# EAGLE design touch_555 (EAGLE 6.5.0)
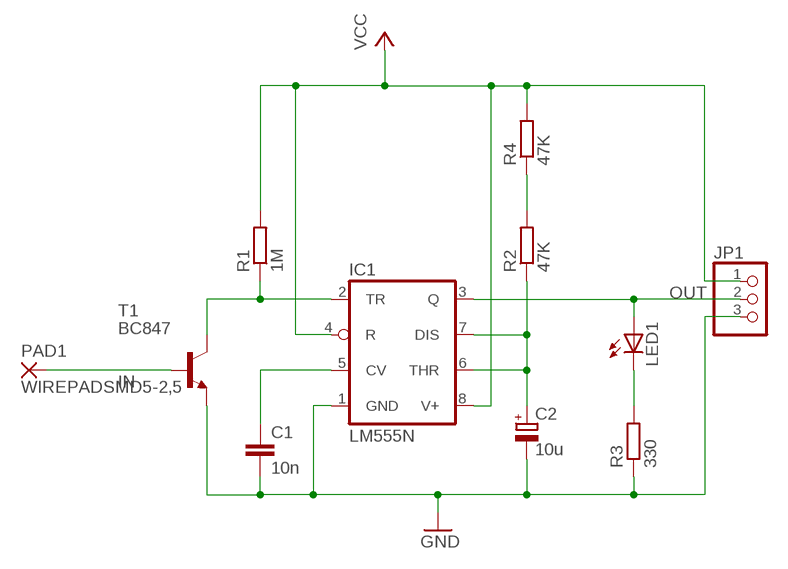
[diagram p0: schematic, sheet 1]

## Parts
C1  10n  C-EUC0805  [C0805]
C2  10u  CPOL-EUE2.5-6  [E2,5-6]
IC1  LM555N  [DIL08]
JP1  PINHD-1X3  [1X03]
LED1  LEDCHIPLED_1206  [CHIPLED_1206]
PAD1  WIREPADSMD5-2,5  [5-2,5]
R1  1M  R-EU_R0805  [R0805]
R2  47K  R-EU_R0805  [R0805]
R3  330  R-EU_R0805  [R0805]
R4  47K  R-EU_R0805  [R0805]
T1  BC847  [SOT23]

## Nets
GND: C1.2 C2.- IC1.1(GND) JP1.3 R3.1 T1.2(E)
IN: PAD1.1(P) T1.1(B)
N$2: LED1.C R3.2
N$3: R2.2 R4.1
N$4: C1.1 IC1.5(CV)
N$5: IC1.2(TR) R1.1 T1.3(C)
N$6: C2.+ IC1.6(THR) IC1.7(DIS) R2.1
OUT: IC1.3(Q) JP1.2 LED1.A
VCC: IC1.4(R) IC1.8(V+) JP1.1 R1.2 R4.2

## Library data of the parts
C1 = resistor:C-EU: CAPACITOR, European symbol
C2 = rcl:CPOL-EU: POLARIZED CAPACITOR, European symbol
IC1 = linear:*555: TIMER
JP1 = pinhead:PINHD-1X3: PIN HEADER
LED1 = led:LED: LED OSRAM: - CHIPLED LG R971, LG N971, LY N971, LG Q971, LY Q971, LO R971, LY R971 LH N974, LH R974 LS Q976, LO Q976, LY Q976 LO Q996 - Hyper CHIPLED LW Q18S LB Q993, LB Q99A, LB R99A - SideLED LS A670, LO A670, LY A670, LG A670, LP A670 LB A673, LV A673, LT A673, LW A673 LH A674 LY A675 LS A676, LA A676, LO A676, LY A676, LW A676 LS A679, LY A679, LG A679 - Hyper Micro SIDELED® LS Y876, LA Y876, LO Y876, LY Y876 LT Y87S - SmartLED LW L88C, LW L88S LB L89C, LB L89S, LG L890 LS L89K, LO L89K, LY L89K LS L896, LA L896, LO L896, LY L896 - TOPLED LS T670, LO T670, LY T670, LG T670, LP T670 LSG T670, LSP T670, LSY T670, LOP T670, LYG T670 LG T671, LOG T671, LSG T671 LB T673, LV T673, LT T673, LW T673 LH T674 LS T676, LA T676, LO T676, LY T676, LB T676, LH T676, LSB T676, LW T676 LB T67C, LV T67C, LT T67C, LS T67K, LO T67K, LY T67K, LW E67C LS E67B, LA E67B, LO E67B, LY E67B, LB E67C, LV E67C, LT E67C LW T67C LS T679, LY T679, LG T679 LS T770, LO T770, LY T770, LG T770, LP T770 LB T773, LV T773, LT T773, LW T773 LH T774 LS E675, LA E675, LY E675, LS T675 LS T776, LA T776, LO T776, LY T776, LB T776 LHGB T686 LT T68C, LB T68C - Hyper Mini TOPLED® LB M676 - Mini TOPLED Santana® LG M470 LS M47K, LO M47K, LY M47K Source: http://www.osram.convergy.de LUXEON: - LUMILED® LXK2-PW12-R00, LXK2-PW12-S00, LXK2-PW14-U00, LXK2-PW14-V00 LXK2-PM12-R00, LXK2-PM12-S00, LXK2-PM14-U00 LXK2-PE12-Q00, LXK2-PE12-R00, LXK2-PE12-S00, LXK2-PE14-T00, LXK2-PE14-U00 LXK2-PB12-K00, LXK2-PB12-L00, LXK2-PB12-M00, LXK2-PB14-N00, LXK2-PB14-P00, LXK2-PB14-Q00 LXK2-PR12-L00, LXK2-PR12-M00, LXK2-PR14-Q00, LXK2-PR14-R00 LXK2-PD12-Q00, LXK2-PD12-R00, LXK2-PD12-S00 LXK2-PH12-R00, LXK2-PH12-S00 LXK2-PL12-P00, LXK2-PL12-Q00, LXK2-PL12-R00 Source: www.luxeon.com KINGBRIGHT: KA-3528ASYC Source: www.kingbright.com
PAD1 = wirepad:WIREPAD: Wire PAD connect wire on PCB
R1-R4 = resistor:R-EU_: RESISTOR, European symbol
T1 = transistor:BC847: NPN TRANSISTOR

## Board
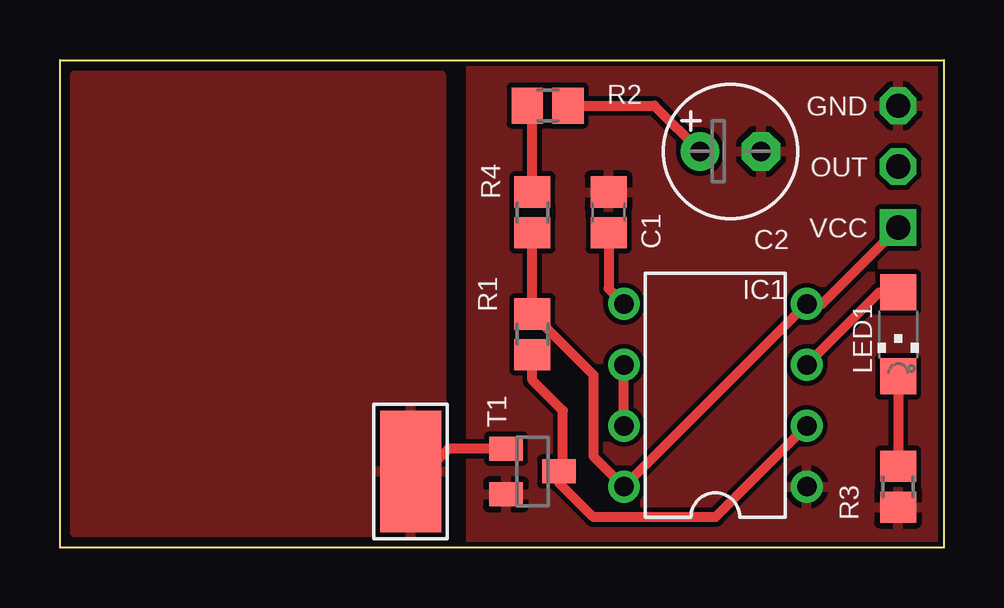
[diagram p1: board, top side]
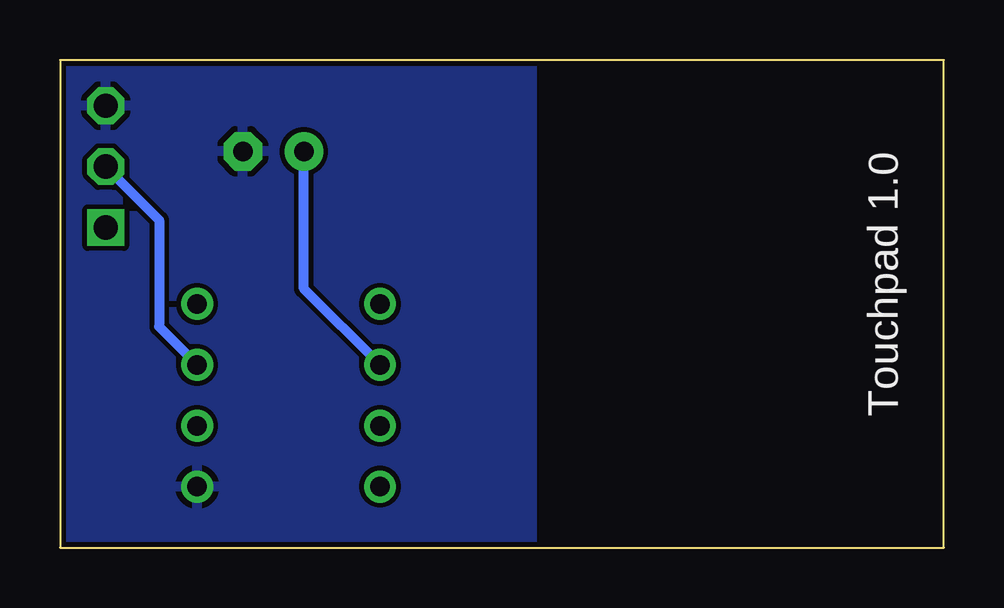
[diagram p2: board, bottom side, seen from below]

Size 36.83 x 20.32 mm. Coordinates in mm from the lower left corner, seen from the top.
Outline: 0,0 0,20.32 36.83,20.32 36.83,0 0,0
Copper layers (1*16): Top 0.035mm / dielectric 1.5mm / Bottom 0.035mm
Design rules "default *": minimum track width 10mil, minimum drill 24mil, track to track 8mil, track to pad 8mil, pad to pad 8mil, via to via 8mil, smd to smd 8mil, copper to edge 8mil, drill to drill 8mil, minimum pad ring 10mil, minimum via ring 8mil, stop-mask expansion 4mil, vias tented up to drill 0mil, thermal gap 10mil

### Footprints (pad centres in the part's own frame; a part is rotated, then mirrored left to right if it is on the bottom)
C0805 = smd 1.3 x 1.5: 1 -0.85,0; 2 0.85,0
E2,5-6 = drill 0.813 pad 1.6: + -1.27,0 | drill 0.813 pad 1.6 octagon: - 1.27,0
DIL08 = drill 0.813 pad 1.27: 1 -3.81,-3.81; 2 -1.27,-3.81; 3 1.27,-3.81; 4 3.81,-3.81; 5 3.81,3.81; 6 1.27,3.81; 7 -1.27,3.81; 8 -3.81,3.81
1X03 = drill 1.016 square: 1 -2.54,0 | drill 1.016 octagon: 2 0,0; 3 2.54,0
CHIPLED_1206 = smd 1.5 x 1.5: A 0,-1.75; C 0,1.75
5-2,5 = smd 2.54 x 5.08: 1 0,0
R0805 = smd 1.3 x 1.5: 1 -0.85,0; 2 0.85,0
SOT23 = smd 1 x 1.4: 1 -0.95,-1.1; 2 0.95,-1.1; 3 0,1.1

### Placement (x,y rotation side)
C1  22.86,13.97 90 top
C2  27.94,16.51 0 top
IC1  27.3,6.35 90 top
JP1  34.92,15.88 90 top
LED1  34.92,8.89 180 top
PAD1  14.61,3.18 0 top
R1  19.68,8.89 90 top
R2  20.32,18.41 180 top
R3  34.92,2.54 90 top
R4  19.68,13.97 270 top
T1  19.68,3.18 270 top

### Tracks (layer width: path | path; a pad name or v marks a point on that pad's centre or on a via)
GND
  pour Top: 17.14,26.67 41.27,26.67 41.27,-3.81 17.14,-3.81
  pour Bottom: 17.14,26.67 41.27,26.67 41.27,-3.81 17.14,-3.81
IN
  Top 0.406: T1.1 16.19,4.12 14.61,2.54
  pour Top: 0.63,19.68 15.88,19.68 15.88,0.64 0.63,0.64
N$2
  Top 0.406: LED1.C R3.2
N$3
  Top 0.406: R4.1 19.68,18.2 R2.2
N$4
  Top 0.406: C1.1 22.86,10.79 IC1.5
N$5
  Top 0.406: IC1.2 27.3,1.27 22.23,1.27 20.79,2.71 T1.3 20.95,3.35 20.95,5.71 19.68,6.99 R1.1
N$6
  Top 0.406: IC1.7 IC1.6 | R2.1 24.77,18.41 C2.+
  Bottom 0.406: IC1.6 26.67,10.79 C2.+
OUT
  Top 0.406: IC1.3 34.13,10.64 LED1.A
  Bottom 0.406: JP1.2 32.7,13.65 32.7,9.21 IC1.3
VCC
  Top 0.406: JP1.1 31.75,10.16 IC1.4 IC1.8 22.23,3.81 22.23,7.2 R1.2 R4.2

### Text on the board
tNames: GND | OUT | VCC
bNames: Touchpad 1.0